# EAGLE schematic DressCode (EAGLE 6.4)
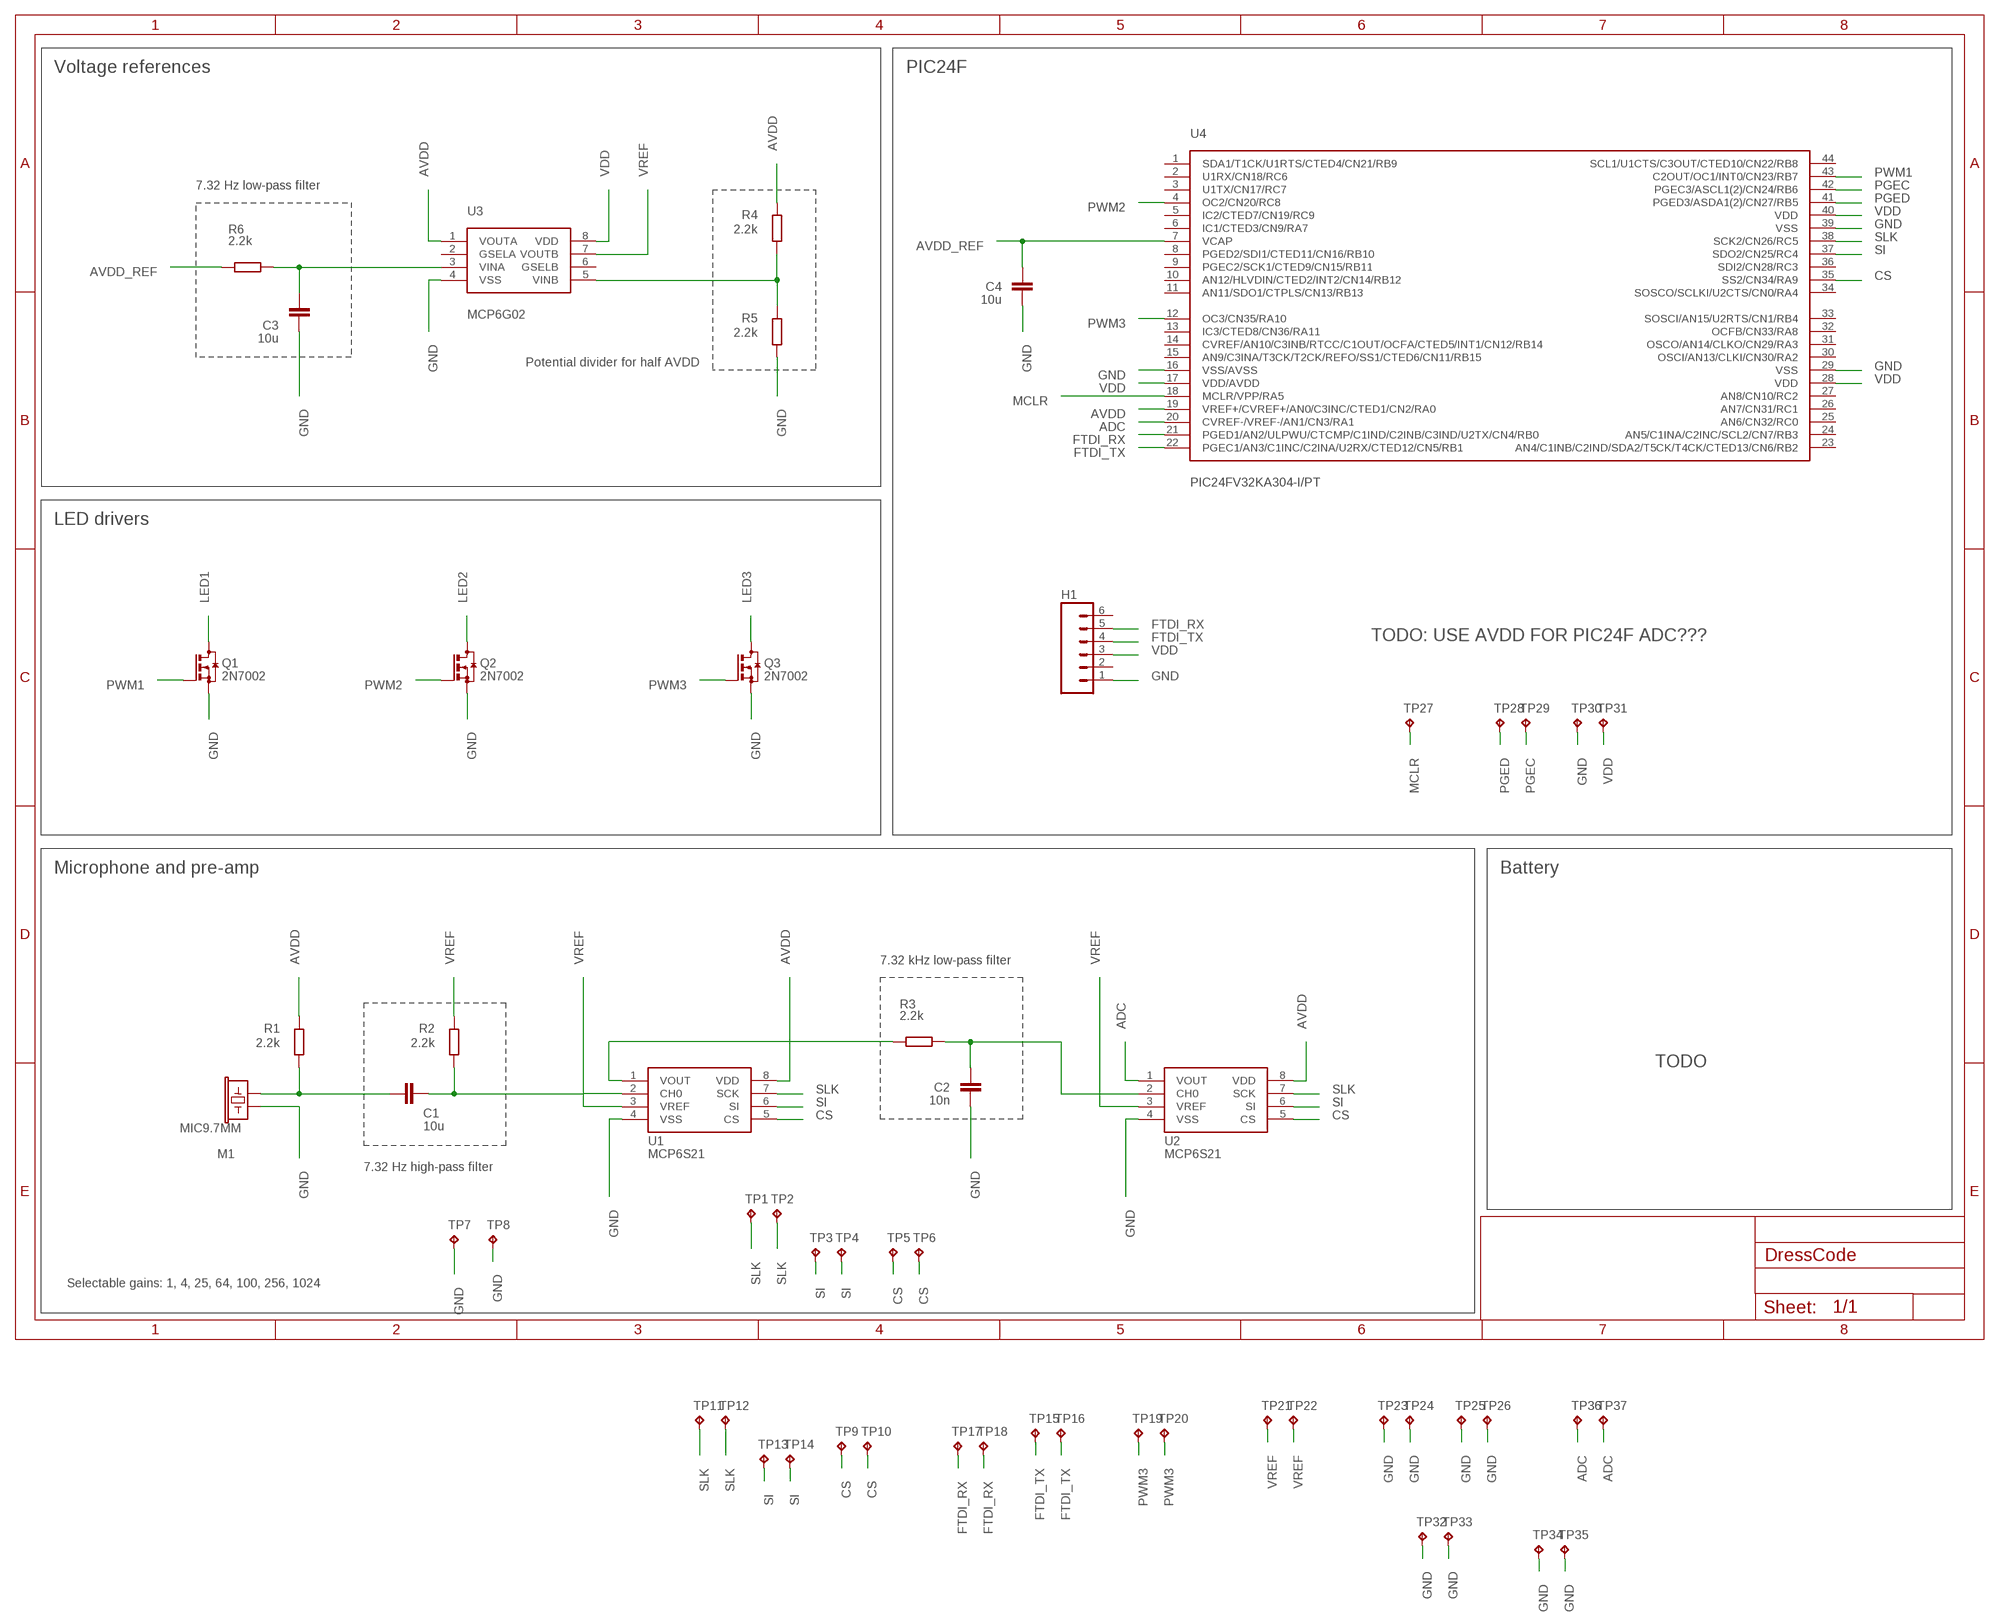
[diagram p0: schematic, sheet 1]

## Parts
C1  10u  C-EUC0805  [C0805]
C2  10n  C-EUC0805  [C0805]
C3  10u  C-EUC0805  [C0805]
C4  10u  C-EUC0805  [C0805]
H1  M06LOCK  [1X06_LOCK]
M1  MIC9.7MM  [MIC-9.7MM]
Q1  2N7002  BSS123  [SOT23]
Q2  2N7002  BSS123  [SOT23]
Q3  2N7002  BSS123  [SOT23]
R1  2.2k  R-EU_R0805  [R0805]
R2  2.2k  R-EU_R0805  [R0805]
R3  2.2k  R-EU_R0805  [R0805]
R4  2.2k  R-EU_R0805  [R0805]
R5  2.2k  R-EU_R0805  [R0805]
R6  2.2k  R-EU_R0805  [R0805]
TP1  TPTP08R  [TP08R]
TP2  TPTP08R  [TP08R]
TP3  TPTP08R  [TP08R]
TP4  TPTP08R  [TP08R]
TP5  TPTP08R  [TP08R]
TP6  TPTP08R  [TP08R]
TP7  TPTP08R  [TP08R]
TP8  TPTP08R  [TP08R]
TP9  TPTP08R  [TP08R]
TP10  TPTP08R  [TP08R]
TP11  TPTP08R  [TP08R]
TP12  TPTP08R  [TP08R]
TP13  TPTP08R  [TP08R]
TP14  TPTP08R  [TP08R]
TP15  TPTP08R  [TP08R]
TP16  TPTP08R  [TP08R]
TP17  TPTP08R  [TP08R]
TP18  TPTP08R  [TP08R]
TP19  TPTP08R  [TP08R]
TP20  TPTP08R  [TP08R]
TP21  TPTP08R  [TP08R]
TP22  TPTP08R  [TP08R]
TP23  TPTP08R  [TP08R]
TP24  TPTP08R  [TP08R]
TP25  TPTP08R  [TP08R]
TP26  TPTP08R  [TP08R]
TP27  TPTP08R  [TP08R]
TP28  TPTP08R  [TP08R]
TP29  TPTP08R  [TP08R]
TP30  TPTP08R  [TP08R]
TP31  TPTP08R  [TP08R]
TP32  TPTP08R  [TP08R]
TP33  TPTP08R  [TP08R]
TP34  TPTP08R  [TP08R]
TP35  TPTP08R  [TP08R]
TP36  TPTP08R  [TP08R]
TP37  TPTP08R  [TP08R]
U1  MCP6S21  [SOIC-8]
U2  MCP6S21  [SOIC-8]
U3  MCP6G02  [SOIC-8]
U4  PIC24FV32KA304-I/PT  [TQFP44]

## Nets
ADC: TP36.TP TP37.TP U2.1(VOUT) U4.20(CVREF-/VREF-/AN1/CN3/RA1)
AVDD: R1.2 R4.2 U1.8(VDD) U2.8(VDD) U3.1(VOUTA) U4.19(VREF+/CVREF+/AN0/C3INC/CTED1/CN2/RA0)
AVDD_REF: C4.2 R6.1 U4.7(VCAP)
CS: TP5.TP TP6.TP TP9.TP TP10.TP U1.5(CS) U2.5(CS) U4.35(SS2/CN34/RA9)
FTDI_RX: H1.5 TP17.TP TP18.TP U4.21(PGED1/AN2/ULPWU/CTCMP/C1IND/C2INB/C3IND/U2TX/CN4/RB0)
FTDI_TX: H1.4 TP15.TP TP16.TP U4.22(PGEC1/AN3/C1INC/C2INA/U2RX/CTED12/CN5/RB1)
GND: C2.2 C3.1 C4.1 H1.1 M1.2 Q1.2(S) Q2.2(S) Q3.2(S) R5.1 TP7.TP TP8.TP TP23.TP TP24.TP TP25.TP TP26.TP TP30.TP TP32.TP TP33.TP TP34.TP TP35.TP U1.4(VSS) U2.4(VSS) U3.4(VSS) U4.16(VSS/AVSS) U4.29(VSS) U4.39(VSS)
LED1: Q1.3(D)
LED2: Q2.3(D)
LED3: Q3.3(D)
MCLR: TP27.TP U4.18(MCLR/VPP/RA5)
N$1: C1.1 M1.1 R1.1
N$2: C1.2 R2.1 U1.2(CH0)
N$3: C2.1 R3.2 U2.2(CH0)
N$4: R3.1 U1.1(VOUT)
N$5: C3.2 R6.2 U3.3(VINA)
N$6: R4.1 R5.2 U3.5(VINB)
PGEC: TP29.TP U4.42(PGEC3/ASCL1(2)/CN24/RB6)
PGED: TP28.TP U4.41(PGED3/ASDA1(2)/CN27/RB5)
PWM1: Q1.1(G) U4.43(C2OUT/OC1/INT0/CN23/RB7)
PWM2: Q2.1(G) U4.4(OC2/CN20/RC8)
PWM3: Q3.1(G) TP19.TP TP20.TP U4.12(OC3/CN35/RA10)
SI: TP3.TP TP4.TP TP13.TP TP14.TP U1.6(SI) U2.6(SI) U4.37(SDO2/CN25/RC4)
SLK: TP1.TP TP2.TP TP11.TP TP12.TP U1.7(SCK) U2.7(SCK) U4.38(SCK2/CN26/RC5)
VDD: H1.3 TP31.TP U3.8(VDD) U4.17(VDD/AVDD) U4.28(VDD) U4.40(VDD)
VREF: R2.2 TP21.TP TP22.TP U1.3(VREF) U2.3(VREF) U3.7(VOUTB)
Unconnected: H1.2 H1.6 U3.2(GSELA) U3.6(GSELB) U4.1(SDA1/T1CK/U1RTS/CTED4/CN21/RB9) U4.2(U1RX/CN18/RC6) U4.3(U1TX/CN17/RC7) U4.5(IC2/CTED7/CN19/RC9) U4.6(IC1/CTED3/CN9/RA7) U4.8(PGED2/SDI1/CTED11/CN16/RB10) U4.9(PGEC2/SCK1/CTED9/CN15/RB11) U4.10(AN12/HLVDIN/CTED2/INT2/CN14/RB12) U4.11(AN11/SDO1/CTPLS/CN13/RB13) U4.13(IC3/CTED8/CN36/RA11) U4.14(CVREF/AN10/C3INB/RTCC/C1OUT/OCFA/CTED5/INT1/CN12/RB14) U4.15(AN9/C3INA/T3CK/T2CK/REFO/SS1/CTED6/CN11/RB15) U4.23(AN4/C1INB/C2IND/SDA2/T5CK/T4CK/CTED13/CN6/RB2) U4.24(AN5/C1INA/C2INC/SCL2/CN7/RB3) U4.25(AN6/CN32/RC0) U4.26(AN7/CN31/RC1) U4.27(AN8/CN10/RC2) U4.30(OSCI/AN13/CLKI/CN30/RA2) U4.31(OSCO/AN14/CLKO/CN29/RA3) U4.32(OCFB/CN33/RA8) U4.33(SOSCI/AN15/U2RTS/CN1/RB4) U4.34(SOSCO/SCLKI/U2CTS/CN0/RA4) U4.36(SDI2/CN28/RC3) U4.44(SCL1/U1CTS/C3OUT/CTED10/CN22/RB8)

## Notes on the sheet
- Voltage references | PIC24F
- 7.32 Hz low-pass filter
- Potential divider for half AVDD
- LED drivers
- TODO: USE AVDD FOR PIC24F ADC???
- Microphone and pre-amp | Battery
- 7.32 kHz low-pass filter
- TODO
- 7.32 Hz high-pass filter
- Selectable gains: 1, 4, 25, 64, 100, 256, 1024

## Library data of the parts
C1-C4 = rcl:C-EU: CAPACITOR, European symbol
H1 = SparkFun:M06: Header 6 Standard 6-pin 0.1" header. Use with straight break away headers (SKU : PRT-00116), right angle break away headers (PRT-00553), swiss pins (PRT-00743), machine pins (PRT-00117), and female headers (PRT-00115). Molex polarized connector foot print use with SKU : PRT-08094 with associated crimp pins and housings. NOTES ON THE VARIANTS LOCK and LOCK_LONGPADS... This footprint was designed to help hold the alignment of a through-hole component (i.e. 6-pin header) while soldering it into place. You may notice that each hole has been shifted either up or down by 0.005 of an inch from it's more standard position (which is a perfectly straight line). This slight alteration caused the pins (the squares in the middle) to touch the edges of the holes. Because they are alternating, it causes a "brace" to hold the component in place. 0.005 has proven to be the perfect amount of "off-center" position when using our standard breakaway headers. Although looks a little odd when you look at the bare footprint, once you have a header in there, the alteration is very hard to notice. Also, if you push a header all the way into place, it is covered up entirely on the bottom side. This idea of altering the position of holes to aid alignment will be further integrated into the Sparkfun Library for other footprints. It can help hold any component with 3 or more connection pins.
M1 = SparkFun:MIC: Microphone Omni-directional electret microphone. 9.7mm standard diameter.
Q1-Q3 = transistor-small-signal:BSS123: N-CHANNEL MOS FET
R1-R6 = rcl:R-EU_: RESISTOR, European symbol
TP1-TP37 = testpad:TP: Test pad
U1 U2 = x-io:MCP6S21
U3 = x-io:MCP6G02
U4 = x-io:PIC24FV32KA304